# Altium schematic sheet 08. NET_DP83848K.SchDoc
size A4; CheckedBy: 黄钦宁; Author: 陈坤; DocumentNumber: 8; SheetNumber: 8; SheetTotal: 13; PageSetup: Record=PageOptions|CenterHorizontal=True|CenterVertical=True|PrintScale=1.00|XCorrection=1.00|YCorrection=1.00|PrintKind=0|BorderSize=5000000|LeftOffset=0|BottomOffset=0|Orientation=2|PaperLength=1000|PaperWidth=1000|Scale=100|PaperSource=7|PrintQuality=600|MediaType=1|DitherType=10|PaperKind=A4|PrintScaleMode=1; DesignDate: 2013-08-16; CheckDate: 2013-12-28; SheetName: NET; SheetVersion: V1.00; SheetDescription: NET DP83848K; ProductName: EasyARM-iMX28学习套件; ProductModel: EasyARM-iMX283
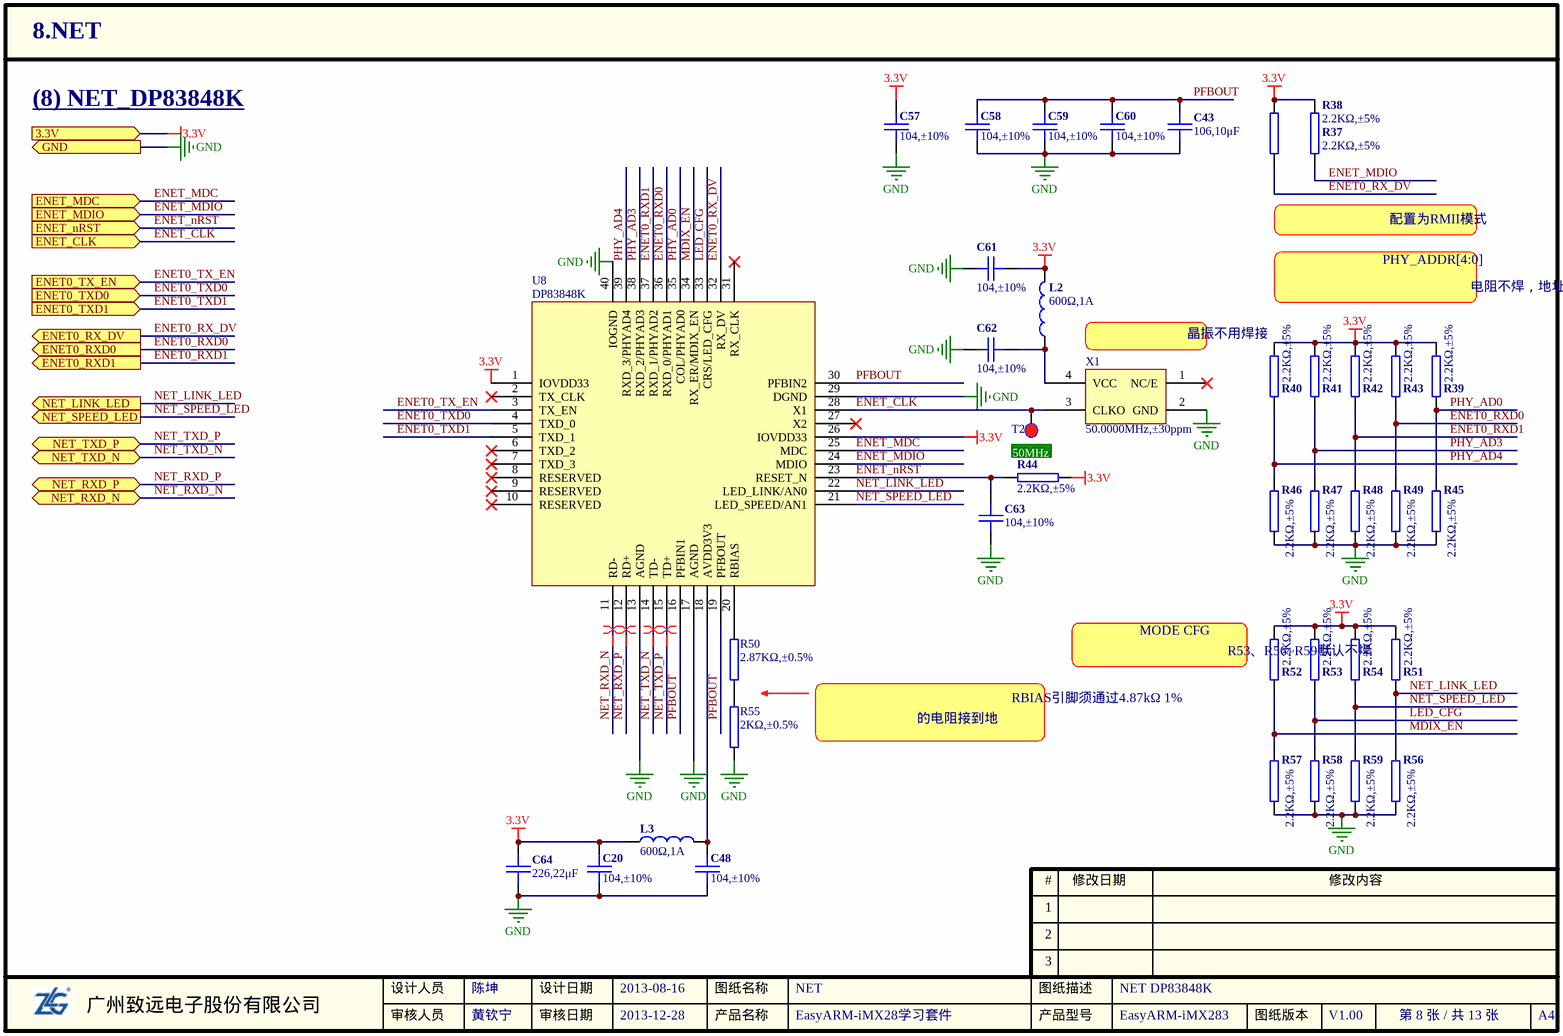
[diagram p0: 08. NET_DP83848K.SchDoc]

## Parts
C20  104,±10%  [0603C]
C43  106,10μF  [0805C]
C48  104,±10%  [0603C]
C57  104,±10%  [0603C]
C58  104,±10%  [0603C]
C59  104,±10%  [0603C]
C60  104,±10%  [0603C]
C61  104,±10%  [0603C]
C62  104,±10%  [0603C]
C63  104,±10%  [0603C]
C64  226,22μF  [0805C]
L2  value 600Ω,1A  [0603R]  (hidden comment: INDUCTOR1)
L3  value 600Ω,1A  [0603R]  (hidden comment: INDUCTOR1)
R37  2.2KΩ,±5%  [0603R]
R38  2.2KΩ,±5%  [0603R]
R39  2.2KΩ,±5%  [0603R]
R40  2.2KΩ,±5%  [0603R]
R41  2.2KΩ,±5%  [0603R]
R42  2.2KΩ,±5%  [0603R]
R43  2.2KΩ,±5%  [0603R]
R44  2.2KΩ,±5%  [0603R]
R45  2.2KΩ,±5%  [0603R]
R46  2.2KΩ,±5%  [0603R]
R47  2.2KΩ,±5%  [0603R]
R48  2.2KΩ,±5%  [0603R]
R49  2.2KΩ,±5%  [0603R]
R50  2.87KΩ,±0.5%  [0603R]
R51  2.2KΩ,±5%  [0603R]
R52  2.2KΩ,±5%  [0603R]
R53  2.2KΩ,±5%  [0603R]
R54  2.2KΩ,±5%  [0603R]
R55  2KΩ,±0.5%  [0603R]
R56  2.2KΩ,±5%  [0603R]
R57  2.2KΩ,±5%  [0603R]
R58  2.2KΩ,±5%  [0603R]
R59  2.2KΩ,±5%  [0603R]
T2  50MHz  [PAD-40]  (value not drawn)  (no BOM)
U8  DP83848K  [QFN50P600X600X100-41N]
X1  value 50.0000MHz,±30ppm  [XTAL4-5X3A]  (hidden comment: XTAL4-B)

## Ports
3.3V (in), ENET0_RX_DV (out), ENET0_RXD0 (out), ENET0_RXD1 (out), ENET0_TX_EN (in), ENET0_TXD0 (in), ENET0_TXD1 (in), ENET_CLK (in), ENET_MDC (in), ENET_MDIO (in), ENET_nRST (in), GND (out), NET_LINK_LED (out), NET_RXD_N (bidir), NET_RXD_P (bidir), NET_SPEED_LED (out), NET_TXD_N (bidir), NET_TXD_P (bidir)

## Nets
3.3V: C20.1 C57.1 C61.2 C64.1 L2.1 L3.2 R37.2 R38.2 R39.1 R40.1 R41.1 R42.1 R43.1 R44.1 R51.1 R52.1 R53.1 R54.1 U8.1(IOVDD33) U8.26(IOVDD33) ; port 3.3V
GND: C20.2 C43.2 C48.2 C57.2 C58.2 C59.2 C60.2 C61.1 C62.1 C63.1 C64.2 R45.2 R46.2 R47.2 R48.2 R49.2 R55.1 R56.2 R57.2 R58.2 R59.2 U8.13(AGND) U8.17(AGND) U8.29(DGND) U8.40(IOGND) U8.41(DAP) X1.2(GND) ; port GND
ENET0_RX_DV: R37.1 U8.32(RX_DV) ; port ENET0_RX_DV
ENET0_RXD0: R43.2 R49.1 U8.36(RXD_0/PHYAD1) ; port ENET0_RXD0
ENET0_RXD1: R42.2 R48.1 U8.37(RXD_1/PHYAD2) ; port ENET0_RXD1
ENET0_TX_EN: U8.3(TX_EN) ; port ENET0_TX_EN
ENET0_TXD0: U8.4(TXD_0) ; port ENET0_TXD0
ENET0_TXD1: U8.5(TXD_1) ; port ENET0_TXD1
ENET_CLK: T2.1 U8.28(X1) X1.3(CLKO) ; port ENET_CLK
ENET_MDC: U8.25(MDC) ; port ENET_MDC
ENET_MDIO: R38.1 U8.24(MDIO) ; port ENET_MDIO
ENET_nRST: C63.2 R44.2 U8.23(RESET_N) ; port ENET_nRST
LED_CFG: R53.2 R58.1 U8.33(CRS/LED_CFG)
MDIX_EN: R52.2 R57.1 U8.34(RX_ER/MDIX_EN)
NET_LINK_LED: R51.2 R56.1 U8.22(LED_LINK/AN0) ; port NET_LINK_LED
NET_RXD_N: U8.11(RD-) ; port NET_RXD_N
NET_RXD_P: U8.12(RD+) ; port NET_RXD_P
NET_SPEED_LED: R54.2 R59.1 U8.21(LED_SPEED/AN1) ; port NET_SPEED_LED
NET_TXD_N: U8.14(TD-) ; port NET_TXD_N
NET_TXD_P: U8.15(TD+) ; port NET_TXD_P
PFBOUT: C43.1 C58.1 C59.1 C60.1 U8.16(PFBIN1) U8.19(PFBOUT) U8.30(PFBIN2)
PHY_AD0: R39.2 R45.1 U8.35(COL/PHYAD0)
PHY_AD3: R41.2 R47.1 U8.38(RXD_2/PHYAD3)
PHY_AD4: R40.2 R46.1 U8.39(RXD_3/PHYAD4)
NetC48_1: C48.1 L3.1 U8.18(AVDD3V3)
NetC62_2: C62.2 L2.2 X1.4(VCC)
NetR50_1: R50.1 R55.2
NetR50_2: R50.2 U8.20(RBIAS)

Not connected (* = marked no-connect by the designer): U8 2(TX_CLK)* 6(TXD_2)* 7(TXD_3)* 8(RESERVED)* 9(RESERVED)* 10(RESERVED)* 27(X2)* 31(RX_CLK)*; X1 1(NC/E)*

## Layout directives
differential pair: NET_RXD_N, NET_RXD_P, NET_TXD_N, NET_TXD_P

## Notes on the sheet
- (8) NET_DP83848K
- 配置为RMII模式
- PHY_ADDR[4:0]
- 电阻不焊，地址默认为00001
- (near X1) 晶振不用焊接
- 50MHz
- MODE CFG
- (near R52) R53、R56~R59默认不焊
- RBIAS引脚须通过4.87kΩ 1%
- 的电阻接到地
- 1
- #
- 修改日期
- 修改内容
- 2
- 3
- 广州致远电子股份有限公司
- 设计人员
- 审核人员
- 设计日期
- 审核日期
- 产品名称
- 图纸名称
- 产品型号
- 图纸描述
- 图纸版本
- A4

## Library data of the parts
C20 C48 C57-C62 = 1.02.01.0032: 104,±10%,50V,X7R,0603,*,RoHS; 名称: 电容; 封装: 0603; 设备封装名称: C0603_104_X7R_50V_10%; 贴片和直插: SMT; 器件优选方案: 优先选用; 物料代码: 1.02.01.0032; Value: 104,±10%; RoHS: RoHS; 型号: 104,±10%,50V,X7R; ComponentLink1Description: ErpDataInfo; ComponentLink1URL: http://erp.zlgmcu.com/ErpExt/ErpData/ListMateriel.aspx?pkey=1.02.01.0032
C43 = 1.02.02.0055: 106,10μF,±10%,10V,X5R,0805,RoHS; 名称: 电容; 封装: 0805; 设备封装名称: C0805_106_X5R_10V_10%; 贴片和直插: SMT; 物料代码: 1.02.02.0055; Value: 106,10μF; RoHS: RoHS; 型号: 106,10μF,±10%,10V,X5R; ComponentLink1Description: ErpDataInfo; ComponentLink1URL: http://erp.zlgmcu.com/ErpExt/ErpData/ListMateriel.aspx?pkey=1.02.02.0055
C63 = 1.02.01.0032: 104,±10%,50V,X7R,0603,*,RoHS; 名称: 电容; 封装: 0603; 设备封装名称: C0603_104_X7R_50V_10%; 贴片和直插: SMT; 物料代码: 1.02.01.0032; Value: 104,±10%; RoHS: RoHS; 型号: 104,±10%,50V,X7R; ComponentLink1Description: ErpDataInfo; ComponentLink1URL: http://erp.zlgmcu.com/ErpExt/ErpData/ListMateriel.aspx?pkey=1.02.01.0032
C64 = 1.02.02.0059: 226,22μF,±20%,6.3V,X5R,0805,RoHS; 名称: 电容; 封装: 0805; 设备封装名称: C0805_226_X5R_6.3V_20%; 贴片和直插: SMT; 物料代码: 1.02.02.0059; Value: 226,22μF; RoHS: RoHS; 型号: 226,22μF,±20%,6.3V,X5R; ComponentLink1Description: ErpDataInfo; ComponentLink1URL: http://erp.zlgmcu.com/ErpExt/ErpData/ListMateriel.aspx?pkey=1.02.02.0059
L2 L3 = 1.03.03.0012: 600Ω,1A,DCR200mΩ,BH03Y314S-600R,SMD,0603,丰晶,RoHS; 名称: 磁珠; 封装: 0603; 贴片和直插: SMT; 物料代码: 1.03.03.0012; 厂商: 丰晶; RoHS: RoHS; 型号: 600Ω,1A,DCR200mΩ,BH03Y314S-600R,SMD; ComponentLink1Description: ErpDataInfo; ComponentLink1URL: http://erp.zlgmcu.com/ErpExt/ErpData/ListMateriel.aspx?pkey=1.03.03.0012
R37-R49 R51-R54 R56-R59 = 1.01.01.0039: 2.2KΩ,±5%,0603,RoHS; 名称: 电阻; 封装: 0603; 设备封装名称: R0603_2.2K; 贴片和直插: SMT; 物料代码: 1.01.01.0039; Value: 2.2KΩ,±5%; RoHS: RoHS; 型号: 2.2KΩ,±5%; ComponentLink1Description: ErpDataInfo; ComponentLink1URL: http://erp.zlgmcu.com/ErpExt/ErpData/ListMateriel.aspx?pkey=1.01.01.0039
R50 = 1.01.01.0109: 2.87KΩ,±0.5%,0603,*,RoHS; 名称: 电阻; 封装: 0603; 设备封装名称: R0603_2.87K_0.5%; 贴片和直插: SMT; 物料代码: 1.01.01.0109; Value: 2.87KΩ,±0.5%; RoHS: RoHS; 型号: 2.87KΩ,±0.5%; ComponentLink1Description: ErpDataInfo; ComponentLink1URL: http://erp.zlgmcu.com/ErpExt/ErpData/ListMateriel.aspx?pkey=1.01.01.0109
R55 = 1.01.01.0084: 2KΩ,±0.5%,0603,*,RoHS; 名称: 电阻; 封装: 0603; 设备封装名称: R0603_2K_0.5%; 贴片和直插: SMT; 物料代码: 1.01.01.0084; Value: 2KΩ,±0.5%; RoHS: RoHS; 型号: 2KΩ,±0.5%; ComponentLink1Description: ErpDataInfo; ComponentLink1URL: http://erp.zlgmcu.com/ErpExt/ErpData/ListMateriel.aspx?pkey=1.01.01.0084
T2 = TEST-DOT
U8 = DP83848K: Industrial Temperature Single Port 10/100 Ethernet Transceiver
X1 = 1.07.03.0037: 50.0000MHz,±30ppm,3.3V,OE,-40~85℃,SMD5032,,RoHS; 名称: 晶体振荡器; 贴片和直插: SMT; 物料代码: 1.07.03.0037; 封装: SMD5032; RoHS: RoHS; 型号: 50.0000MHz,±30ppm,3.3V,OE,-40~85℃; ComponentLink1Description: ErpDataInfo; ComponentLink1URL: http://erp.zlgmcu.com/ErpExt/ErpData/ListMateriel.aspx?pkey=1.07.03.0037